# EAGLE schematic amphenol_npa201_edgemount (EAGLE 8.2.2)
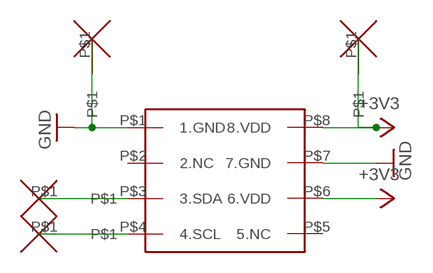
[diagram p0: schematic, sheet 1]

## Parts
U$1  AMPHENOL_NPA201EDGEMOUNT  [AMPHENOL_NPA201_EDGEMOUNT]
U$2  WIREPADWIREPAD_0,5/0,3  [WIREPAD_0,5/0,3]
U$3  WIREPADWIREPAD_0,5/0,3  [WIREPAD_0,5/0,3]
U$4  WIREPADWIREPAD_0,5/0,3  [WIREPAD_0,5/0,3]
U$5  WIREPADWIREPAD_0,5/0,3  [WIREPAD_0,5/0,3]

## Nets
+3V3: U$1.P$6(6.VDD) U$1.P$8(8.VDD) U$5.P$1
GND: U$1.P$1(1.GND) U$1.P$7(7.GND) U$4.P$1
N$1: U$1.P$3(3.SDA) U$2.P$1
N$2: U$1.P$4(4.SCL) U$3.P$1
Unconnected: U$1.P$2(2.NC) U$1.P$5(5.NC)

## Library data of the parts
U$1 = Sombeck_lib:AMPHENOL_NPA201
U$2-U$5 = Sombeck_lib:WIREPAD